# EAGLE design 7 Segment master (EAGLE 9.6.2)
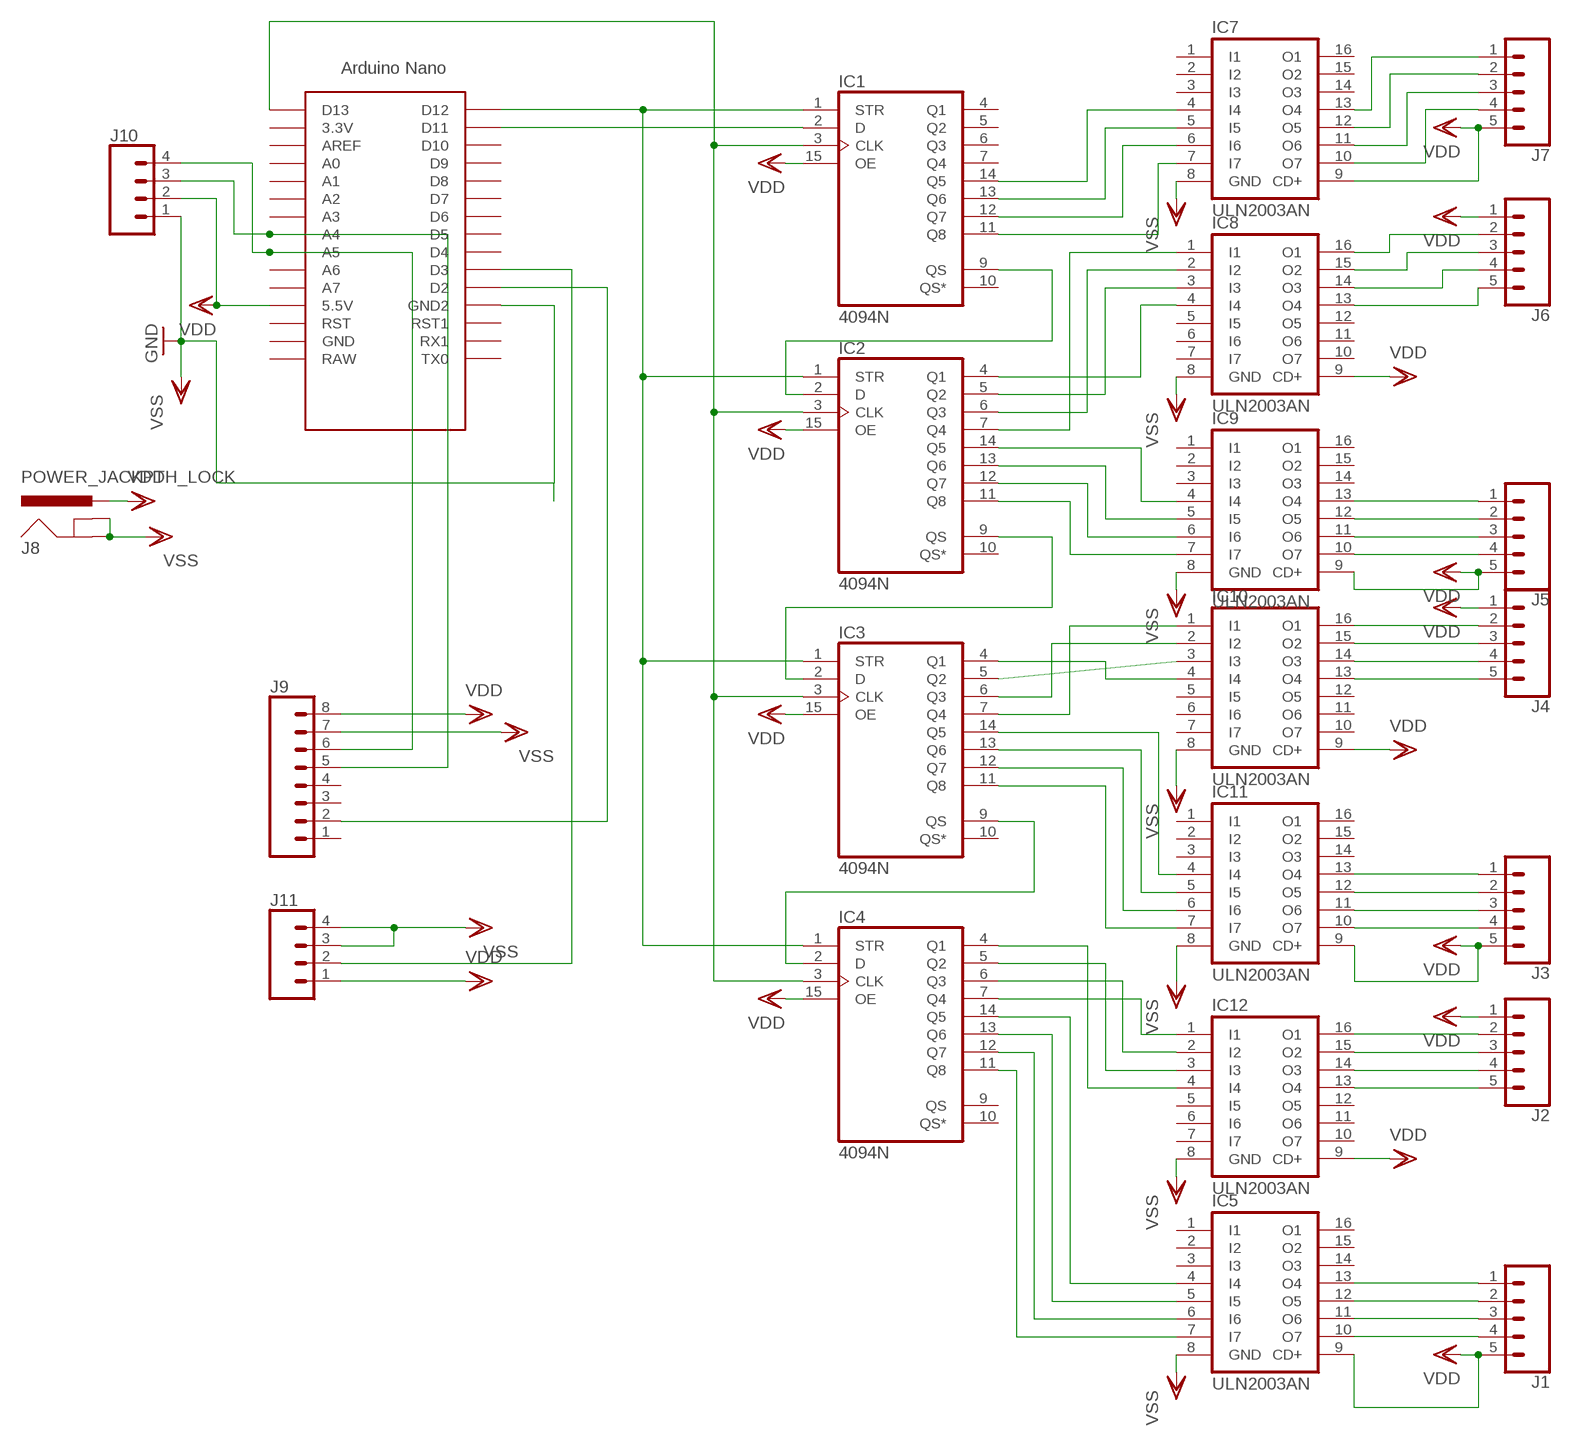
[diagram p0: schematic, sheet 1]

## Parts
IC1  4094N  [DIL16]
IC2  4094N  [DIL16]
IC3  4094N  [DIL16]
IC4  4094N  [DIL16]
IC5  ULN2003AN  [DIL16]
IC7  ULN2003AN  [DIL16]
IC8  ULN2003AN  [DIL16]
IC9  ULN2003AN  [DIL16]
IC10  ULN2003AN  [DIL16]
IC11  ULN2003AN  [DIL16]
IC12  ULN2003AN  [DIL16]
J1  CONN_05LOCK_LONGPADS  [1X05_LOCK_LONGPADS]
J2  CONN_05LOCK_LONGPADS  [1X05_LOCK_LONGPADS]
J3  CONN_05LOCK_LONGPADS  [1X05_LOCK_LONGPADS]
J4  CONN_05LOCK_LONGPADS  [1X05_LOCK_LONGPADS]
J5  CONN_05LOCK_LONGPADS  [1X05_LOCK_LONGPADS]
J6  CONN_05LOCK_LONGPADS  [1X05_LOCK_LONGPADS]
J7  CONN_05LOCK_LONGPADS  [1X05_LOCK_LONGPADS]
J8  POWER_JACKPTH_LOCK  [POWER_JACK_PTH_LOCK]
J9  CONN_08LOCK_LONGPADS  [1X08_LOCK_LONGPADS]
J10  CONN_04  [SCREWTERMINAL-5MM-4]
J11  CONN_04LOCK_LONGPADS  [1X04_LOCK_LONGPADS]
U$1  NANO  [NANO]

## Nets
N$1: IC1.3(CLK) IC2.3(CLK) IC3.3(CLK) IC4.3(CLK) U$1.D13
N$2: IC1.2(D) U$1.D11
N$3: IC1.9(QS) IC2.2(D)
N$4: IC2.9(QS) IC3.2(D)
N$5: IC1.1(STR) IC2.1(STR) IC3.1(STR) IC4.1(STR) U$1.D12
N$6: IC3.9(QS) IC4.2(D)
N$7: IC1.14(Q5) IC7.4(I4)
N$8: IC1.13(Q6) IC7.5(I5)
N$9: IC1.12(Q7) IC7.6(I6)
N$10: IC1.11(Q8) IC7.7(I7)
N$11: IC2.4(Q1) IC8.4(I4)
N$12: IC2.5(Q2) IC8.3(I3)
N$13: IC2.6(Q3) IC8.2(I2)
N$14: IC2.7(Q4) IC8.1(I1)
N$15: IC2.14(Q5) IC9.4(I4)
N$16: IC2.11(Q8) IC9.7(I7)
N$17: IC2.12(Q7) IC9.6(I6)
N$18: IC2.13(Q6) IC9.5(I5)
N$19: IC3.4(Q1) IC10.4(I4)
N$20: IC3.5(Q2) IC10.3(I3)
N$21: IC3.6(Q3) IC10.2(I2)
N$22: IC3.7(Q4) IC10.1(I1)
N$23: IC3.14(Q5) IC11.4(I4)
N$24: IC3.13(Q6) IC11.5(I5)
N$25: IC3.12(Q7) IC11.6(I6)
N$26: IC3.11(Q8) IC11.7(I7)
N$27: IC4.4(Q1) IC12.4(I4)
N$28: IC4.5(Q2) IC12.3(I3)
N$29: IC4.6(Q3) IC12.2(I2)
N$30: IC4.7(Q4) IC12.1(I1)
N$31: IC4.14(Q5) IC5.4(I4)
N$32: IC4.13(Q6) IC5.5(I5)
N$33: IC4.12(Q7) IC5.6(I6)
N$34: IC4.11(Q8) IC5.7(I7)
N$35: IC7.10(O7) J7.4
N$36: IC7.11(O6) J7.3
N$37: IC7.12(O5) J7.2
N$38: IC7.13(O4) J7.1
N$39: IC8.16(O1) J6.2
N$40: IC8.15(O2) J6.3
N$41: IC8.14(O3) J6.4
N$42: IC8.13(O4) J6.5
N$43: IC9.13(O4) J5.1
N$44: IC9.12(O5) J5.2
N$45: IC9.11(O6) J5.3
N$46: IC9.10(O7) J5.4
N$47: IC10.16(O1) J4.2
N$48: IC10.15(O2) J4.3
N$49: IC10.14(O3) J4.4
N$50: IC10.13(O4) J4.5
N$51: IC11.13(O4) J3.1
N$52: IC11.12(O5) J3.2
N$53: IC11.11(O6) J3.3
N$54: IC11.10(O7) J3.4
N$55: IC12.16(O1) J2.2
N$56: IC12.15(O2) J2.3
N$57: IC12.14(O3) J2.4
N$58: IC12.13(O4) J2.5
N$59: IC5.13(O4) J1.1
N$60: IC5.12(O5) J1.2
N$61: IC5.11(O6) J1.3
N$62: IC5.10(O7) J1.4
N$63: J9.6 J10.4 U$1.A5
N$64: J9.5 J10.3 U$1.A4
N$70: J9.2 U$1.D2
N$71: J11.2 U$1.D3
VDD: IC1.15(OE) IC2.15(OE) IC3.15(OE) IC4.15(OE) IC5.9(CD+) IC7.9(CD+) IC8.9(CD+) IC9.9(CD+) IC10.9(CD+) IC11.9(CD+) IC12.9(CD+) J1.5 J2.1 J3.5 J4.1 J5.5 J6.1 J7.5 J8.PWR J9.8 J10.2 J11.1 U$1.5V(5.5V)
VSS: IC5.8(GND) IC7.8(GND) IC8.8(GND) IC9.8(GND) IC10.8(GND) IC11.8(GND) IC12.8(GND) J8.GND J8.GNDBREAK J9.7 J10.1 J11.3 J11.4 U$1.GND1(GND2) ; supply symbol labelled GND
Unconnected: IC1.4(Q1) IC1.5(Q2) IC1.6(Q3) IC1.7(Q4) IC1.10(QS*) IC2.10(QS*) IC3.10(QS*) IC4.9(QS) IC4.10(QS*) IC5.1(I1) IC5.2(I2) IC5.3(I3) IC5.14(O3) IC5.15(O2) IC5.16(O1) IC7.1(I1) IC7.2(I2) IC7.3(I3) IC7.14(O3) IC7.15(O2) IC7.16(O1) IC8.5(I5) IC8.6(I6) IC8.7(I7) IC8.10(O7) IC8.11(O6) IC8.12(O5) IC9.1(I1) IC9.2(I2) IC9.3(I3) IC9.14(O3) IC9.15(O2) IC9.16(O1) IC10.5(I5) IC10.6(I6) IC10.7(I7) IC10.10(O7) IC10.11(O6) IC10.12(O5) IC11.1(I1) IC11.2(I2) IC11.3(I3) IC11.14(O3) IC11.15(O2) IC11.16(O1) IC12.5(I5) IC12.6(I6) IC12.7(I7) IC12.10(O7) IC12.11(O6) IC12.12(O5) J9.1 J9.3 J9.4 U$1.3.3V U$1.A0 U$1.A1 U$1.A2 U$1.A3 U$1.A6 U$1.A7 U$1.AREF U$1.D4 U$1.D5 U$1.D6 U$1.D7 U$1.D8 U$1.D9 U$1.D10 U$1.GND U$1.RAW U$1.RST U$1.RST1 U$1.RX1 U$1.TX0

## Power pins joined to a net without a drawn wire
VDD: IC1.16(VDD) IC2.16(VDD) IC3.16(VDD) IC4.16(VDD)
VSS: IC1.8(VSS) IC2.8(VSS) IC3.8(VSS) IC4.8(VSS)

## Library data of the parts
IC1-IC4 = 40xx:4094: 8-stage SHIFT/STORE REGISTER, tri-state
IC5 IC7-IC12 = uln-udn:ULN2003A: DRIVER ARRAY
J1-J7 = SparkFun-Connectors:CONN_05: Multi connection point. Often used as Generic Header-pin footprint for 0.1 inch spaced/style header connections On any of the 0.1 inch spaced packages, you can populate with these: Break Away Headers - Straight <https://www.sparkfun.com/products/116> (PRT-00116) Break Away Male Headers - Right Angle <https://www.sparkfun.com/products/553> (PRT-00553) Female Headers <https://www.sparkfun.com/products/115> (PRT-00115) Break Away Headers - Machine Pin <https://www.sparkfun.com/products/117> (PRT-00117) Break Away Female Headers - Swiss Machine Pin <https://www.sparkfun.com/products/743> (PRT-00743) For SCREWTERMINALS and SPRING TERMINALS visit here: Screw Terimnals on SparkFun.com <https://www.sparkfun.com/search/results?term=Screw+Terminals> (5mm/3.5mm/2.54mm spacing) This device is also useful as a general connection point to wire up your design to another part of your project. Our various solder wires solder well into these plated through hole pads. Hook-Up Wire - Assortment (Stranded, 22 AWG) <https://www.sparkfun.com/products/11375> (PRT-11375) Hook-Up Wire - Assortment (Solid Core, 22 AWG) <https://www.sparkfun.com/products/11367> (PRT-11367) View the entire wire category on our website here <https://www.sparkfun.com/categories/141> Special notes: Molex polarized connector foot print use with SKU : PRT-08231 with associated crimp pins and housings. 1MM SMD Version SKU: PRT-10208
J8 = SparkFun-Connectors:POWER_JACK: Power Jack Connector This is the standard 5.5mm barrel jack for power. The PTH is the most common, proven, reliable, footprint. The Slot footprint only works if the mill layer is transmitted to the PCB fab house so be warned. Here are the connectors we sell at SparkFun: DC Barrel Power Jack/Connector <https://www.sparkfun.com/products/119> (PRT-00119) DC Barrel Power Jack/Connector (SMD) <https://www.sparkfun.com/products/12748> (PRT-12748) DC Barrel Jack Adapter - Breadboard Compatible <https://www.sparkfun.com/products/10811> (PRT-10811) It is used on this SparkFun product (and many, many others): SparkFun RedBoard - Programmed with Arduino <https://www.sparkfun.com/products/12757> (DEV-12757) Also, if you need a mating power supply or connector, please check these out: Wall Adapter Power Supply - 9VDC 650mA <https://www.sparkfun.com/products/298> (TOL-00298) DC Barrel Jack Adapter - Male <https://www.sparkfun.com/products/10287> (PRT-10287); PROD_ID: CONN-08197; SF_ID: PRT-00119
J9 = SparkFun-Connectors:CONN_08: Multi connection point. Often used as Generic Header-pin footprint for 0.1 inch spaced/style header connections On any of the 0.1 inch spaced packages, you can populate with these: Break Away Headers - Straight <https://www.sparkfun.com/products/116> (PRT-00116) Break Away Male Headers - Right Angle <https://www.sparkfun.com/products/553> (PRT-00553) Female Headers <https://www.sparkfun.com/products/115> (PRT-00115) Break Away Headers - Machine Pin <https://www.sparkfun.com/products/117> (PRT-00117) Break Away Female Headers - Swiss Machine Pin <https://www.sparkfun.com/products/743> (PRT-00743) Arduino Stackable Header - 8 Pin <https://www.sparkfun.com/products/9279> (PRT-09279) For SCREWTERMINALS and SPRING TERMINALS visit here: Screw Terimnals on SparkFun.com <https://www.sparkfun.com/search/results?term=Screw+Terminals> (5mm/3.5mm/2.54mm spacing) This device is also useful as a general connection point to wire up your design to another part of your project. Our various solder wires solder well into these plated through hole pads. Hook-Up Wire - Assortment (Stranded, 22 AWG) <https://www.sparkfun.com/products/11375> (PRT-11375) Hook-Up Wire - Assortment (Solid Core, 22 AWG) <https://www.sparkfun.com/products/11367> (PRT-11367) View the entire wire category on our website here <https://www.sparkfun.com/categories/141> Special notes: Molex polarized connector foot print use with SKU : PRT-08231 with associated crimp pins and housings. 1MM SMD Version SKU: PRT-10208 NOTES ON THE VARIANTS LOCK and LOCK_LONGPADS... This footprint was designed to help hold the alignment of a through-hole component (i.e. 6-pin header) while soldering it into place. You may notice that each hole has been shifted either up or down by 0.005 of an inch from it's more standard position (which is a perfectly straight line). This slight alteration caused the pins (the squares in the middle) to touch the edges of the holes. Because they are alternating, it causes a "brace" to hold the component in place. 0.005 has proven to be the perfect amount of "off-center" position when using our standard breakaway headers. Although looks a little odd when you look at the bare footprint, once you have a header in there, the alteration is very hard to notice. Also,if you push a header all the way into place, it is covered up entirely on the bottom side.
J10 = Chris:CONN_04: Multi connection point. Often used as Generic Header-pin footprint for 0.1 inch spaced/style header connections On any of the 0.1 inch spaced packages, you can populate with these: Break Away Headers - Straight <https://www.sparkfun.com/products/116> (PRT-00116) Break Away Male Headers - Right Angle <https://www.sparkfun.com/products/553> (PRT-00553) Female Headers <https://www.sparkfun.com/products/115> (PRT-00115) Break Away Headers - Machine Pin <https://www.sparkfun.com/products/117> (PRT-00117) Break Away Female Headers - Swiss Machine Pin <https://www.sparkfun.com/products/743> (PRT-00743) For SCREWTERMINALS and SPRING TERMINALS visit here: Screw Terimnals on SparkFun.com <https://www.sparkfun.com/search/results?term=Screw+Terminals> (5mm/3.5mm/2.54mm spacing) This device is also useful as a general connection point to wire up your design to another part of your project. Our various solder wires solder well into these plated through hole pads. Hook-Up Wire - Assortment (Stranded, 22 AWG) <https://www.sparkfun.com/products/11375> (PRT-11375) Hook-Up Wire - Assortment (Solid Core, 22 AWG) <https://www.sparkfun.com/products/11367> (PRT-11367) View the entire wire category on our website here <https://www.sparkfun.com/categories/141> Special notes: Molex polarized connector foot print use with SKU : PRT-08231 with associated crimp pins and housings. 1MM SMD Version SKU: PRT-10208
J11 = SparkFun-Connectors:CONN_04: Multi connection point. Often used as Generic Header-pin footprint for 0.1 inch spaced/style header connections On any of the 0.1 inch spaced packages, you can populate with these: Break Away Headers - Straight <https://www.sparkfun.com/products/116> (PRT-00116) Break Away Male Headers - Right Angle <https://www.sparkfun.com/products/553> (PRT-00553) Female Headers <https://www.sparkfun.com/products/115> (PRT-00115) Break Away Headers - Machine Pin <https://www.sparkfun.com/products/117> (PRT-00117) Break Away Female Headers - Swiss Machine Pin <https://www.sparkfun.com/products/743> (PRT-00743) For SCREWTERMINALS and SPRING TERMINALS visit here: Screw Terimnals on SparkFun.com <https://www.sparkfun.com/search/results?term=Screw+Terminals> (5mm/3.5mm/2.54mm spacing) This device is also useful as a general connection point to wire up your design to another part of your project. Our various solder wires solder well into these plated through hole pads. Hook-Up Wire - Assortment (Stranded, 22 AWG) <https://www.sparkfun.com/products/11375> (PRT-11375) Hook-Up Wire - Assortment (Solid Core, 22 AWG) <https://www.sparkfun.com/products/11367> (PRT-11367) View the entire wire category on our website here <https://www.sparkfun.com/categories/141> Special notes: Molex polarized connector foot print use with SKU : PRT-08231 with associated crimp pins and housings. 1MM SMD Version SKU: PRT-10208; PROD_ID: CONN-09696
U$1 = Arduino-clone:NANO: Arduino Nano

## Board
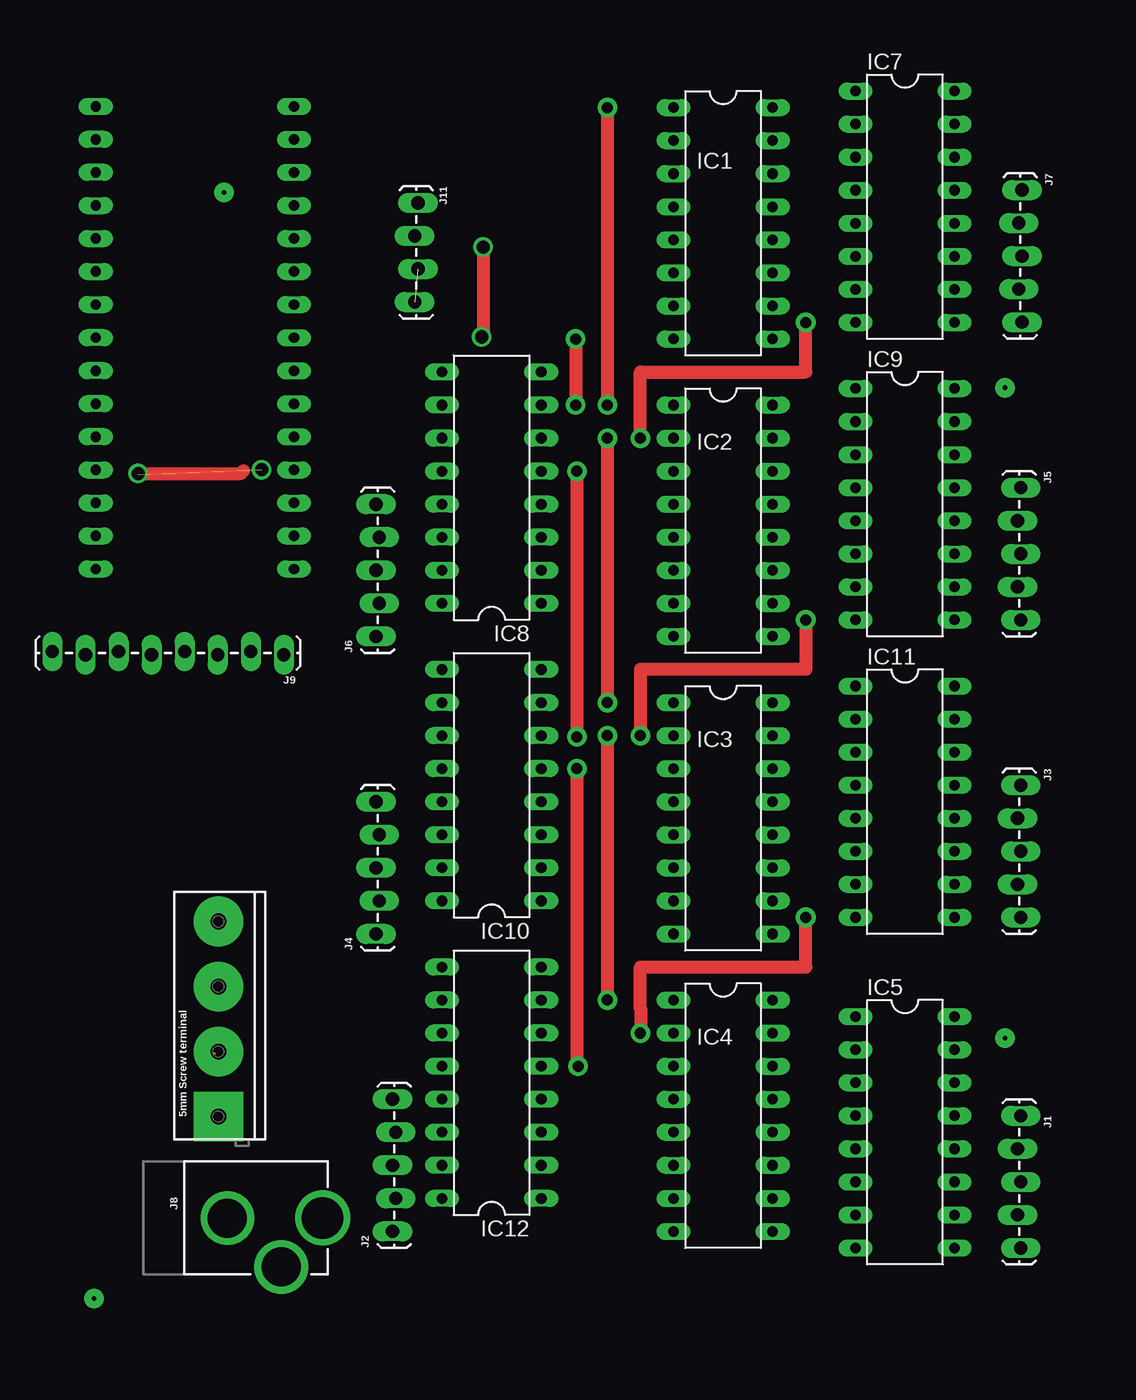
[diagram p1: board, top side]
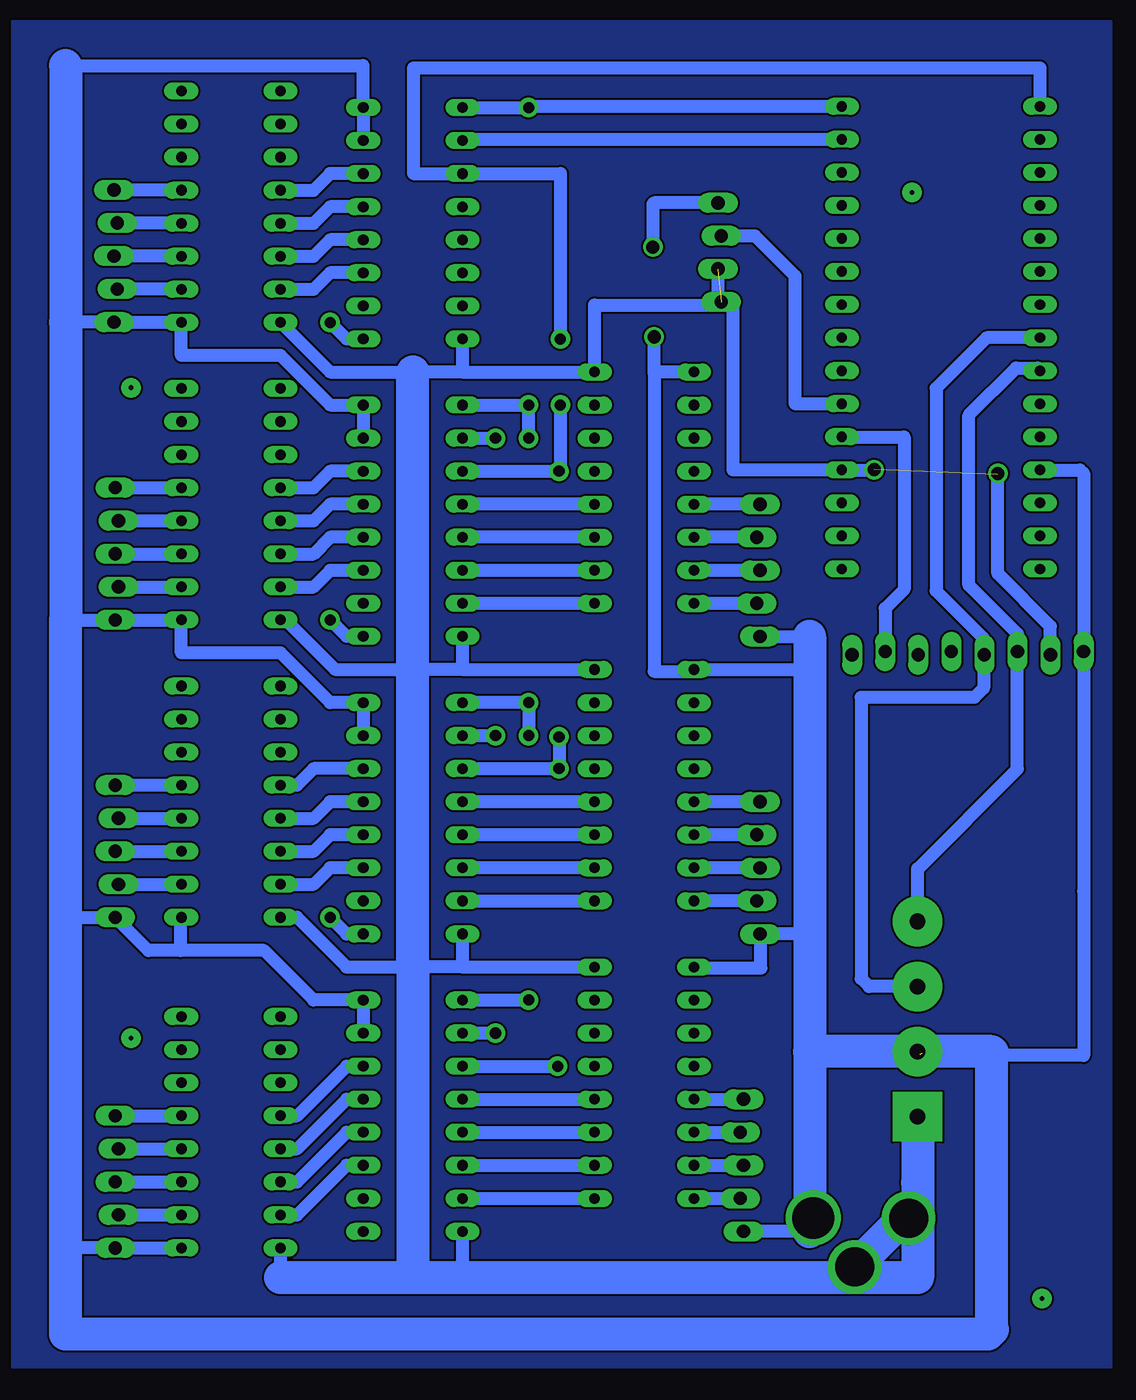
[diagram p2: board, bottom side, seen from below]

No outline drawn. Coordinates in mm, seen from the top.
Copper layers (1*16): Top 0.035mm / dielectric 1.5mm / Bottom 0.035mm
Design rules "default": minimum track width 6mil, minimum drill 0.35mm, track to track 6mil, track to pad 6mil, pad to pad 6mil, via to via 6mil, smd to smd 6mil, copper to edge 40mil, drill to drill 6mil, minimum pad ring 10mil, minimum via ring 8mil, stop-mask expansion 4mil, vias tented up to drill 0mil, thermal gap 10mil

### Footprints (pad centres in the part's own frame; a part is rotated, then mirrored left to right if it is on the bottom)
DIL16 = drill 0.813 long: 1 -8.89,-3.81; 2 -6.35,-3.81; 3 -3.81,-3.81; 4 -1.27,-3.81; 5 1.27,-3.81; 6 3.81,-3.81; 7 6.35,-3.81; 8 8.89,-3.81; 9 8.89,3.81; 10 6.35,3.81; 11 3.81,3.81; 12 1.27,3.81; 13 -1.27,3.81; 14 -3.81,3.81; 15 -6.35,3.81; 16 -8.89,3.81
1X05_LOCK_LONGPADS = drill 1.016 long: 1 0,0; 2 2.54,-0.254; 3 5.08,0; 4 7.62,-0.254; 5 10.16,0
POWER_JACK_PTH_LOCK = drill 2.997 pad 4.115: GND 0.025,6.557; GNDBREAK 3.762,10.7 | drill 3.2 pad 4.115: PWR 0,13.878
1X08_LOCK_LONGPADS = drill 1.016 long: 1 0,0.127; 2 2.54,-0.127; 3 5.08,0.127; 4 7.62,-0.127; 5 10.16,0.127; 6 12.7,-0.127; 7 15.24,0.127; 8 17.78,-0.127
SCREWTERMINAL-5MM-4 = drill 1.2 pad 3.81 square: 1 0,0 | drill 1.2 pad 3.81: 2 5,0; 3 10,0; 4 15,0
1X04_LOCK_LONGPADS = drill 1.016 long: 1 0,0; 2 2.54,-0.254; 3 5.08,0; 4 7.62,-0.254
NANO = drill 0.8 long: 3.3V -10.16,24.13; 5V -10.16,-1.27; A0 -10.16,19.05; A1 -10.16,16.51; A2 -10.16,13.97; A3 -10.16,11.43; A4 -10.16,8.89; A5 -10.16,6.35; A6 -10.16,3.81; A7 -10.16,1.27; AREF -10.16,21.59; D2 5.08,1.27; D3 5.08,3.81; D4 5.08,6.35; D5 5.08,8.89; D6 5.08,11.43; D7 5.08,13.97; D8 5.08,16.51; D9 5.08,19.05; D10 5.08,21.59; D11 5.08,24.13; D12 5.08,26.67; D13 -10.16,26.67; GND -10.16,-6.35; GND1 5.08,-1.27; RAW -10.16,-8.89; RST -10.16,-3.81; RST1 5.08,-3.81; RX1 5.08,-6.35; TX0 5.08,-8.89

### Placement (x,y rotation side)
IC1  53.34,87.63 270 top
IC2  53.34,64.77 270 top
IC3  53.34,41.91 270 top
IC4  53.34,19.05 270 top
IC5  67.31,17.78 270 top
IC7  67.31,88.9 270 top
IC8  35.56,67.31 90 top
IC9  67.31,66.04 270 top
IC10  35.56,44.45 90 top
IC11  67.31,43.18 270 top
IC12  35.56,21.59 90 top
J1  76.2,19.05 270 top
J2  27.94,10.16 90 top
J3  76.2,44.45 270 top
J4  26.67,33.02 90 top
J5  76.2,67.31 270 top
J6  26.67,55.88 90 top
J7  76.3,90.19 270 top
J8  8.7,11.2 270 top
J9  19.6,54.6 180 top
J10  14.57,18.98 90 top
J11  29.9,89.2 270 top
U$1  15.31,69.95 0 top

### Tracks (layer width: path | path; a pad name or v marks a point on that pad's centre or on a via)
_OUTLINES_
  pour Bottom (isolate 0.025, rank 6): 0,0 83.82,0 83.82,102.87 0,102.87
  pour Bottom (isolate 0.1, rank 6): -0.09,-0.09 83.91,-0.09 83.91,102.96 -0.09,102.96
  pour Bottom (isolate 0.1, rank 6): -0.19,-0.19 84.01,-0.19 84.01,103.06 -0.19,103.06
  pour Bottom (isolate 0.1, rank 6): -0.29,-0.29 84.11,-0.29 84.11,103.16 -0.29,103.16
N$1  (via drill 0.85 pad 1.5)
  Top 1.016: v42.01,78.74 v42.01,73.66 | v42.11,68.58 v42.11,48.16 | v42.11,45.72 42.11,22.96 v42.21,22.86
  Bottom 1.016: U$1.D13 5.15,99.56 53.3,99.56 53.3,91.44 IC1.3 42.01,91.44 v42.01,78.74 | IC2.3 v42.11,68.58 42.01,68.68 v42.01,73.66 | IC3.3 v42.11,45.72 v42.11,48.16 | IC4.3 v42.21,22.86
N$2
  Bottom 1.016: U$1.D11 49.43,94.08 IC1.2
N$3  (via drill 0.85 pad 1.5)
  Top 1.016: v46.99,71.12 46.99,76.2 59.69,76.2 v59.69,80.01
  Bottom 1.016: IC1.9 58.42,78.74 v59.69,80.01 | IC2.2 v46.99,71.12
N$4  (via drill 0.85 pad 1.5)
  Top 1.016: v59.69,57.15 59.69,53.34 46.99,53.34 v46.99,48.26
  Bottom 1.016: IC2.9 58.42,55.88 v59.69,57.15 | IC3.2 v46.99,48.26
N$5  (via drill 0.85 pad 1.5)
  Top 1.016: v44.45,71.12 v44.45,50.8 | v44.45,96.52 v44.45,73.66 | v44.45,48.26 v44.45,27.94
  Bottom 1.016: IC1.1 v44.45,96.52 44.35,96.62 U$1.D12 | v44.45,71.12 v44.45,73.66 IC2.1 | IC3.1 v44.45,50.8 v44.45,48.26 | IC4.1 v44.45,27.94
N$6  (via drill 0.85 pad 1.5)
  Top 1.016: v46.99,25.4 47.03,25.44 47.03,27.21 46.99,27.25 46.99,30.48 59.69,30.48 v59.69,34.29
  Bottom 1.016: IC4.2 v46.99,25.4 | IC3.9 58.42,33.02 v59.69,34.29
N$7
  Bottom 1.016: IC1.14 59.69,91.44 60.96,90.17 IC7.4
N$8
  Bottom 1.016: IC1.13 59.69,88.9 60.96,87.63 IC7.5
N$9
  Bottom 1.016: IC1.12 59.69,86.36 60.96,85.09 IC7.6
N$10
  Bottom 1.016: IC1.11 59.69,83.82 60.96,82.55 IC7.7
N$11
  Bottom 1.016: IC8.4 IC2.4
N$12
  Bottom 1.016: IC8.3 IC2.5
N$13
  Bottom 1.016: IC8.2 IC2.6
N$14
  Bottom 1.016: IC8.1 IC2.7
N$15
  Bottom 1.016: IC2.14 59.69,68.58 60.96,67.31 IC9.4
N$16
  Bottom 1.016: IC9.7 60.96,59.69 59.69,60.96 IC2.11
N$17
  Bottom 1.016: IC2.12 59.69,63.5 60.96,62.23 IC9.6
N$18
  Bottom 1.016: IC2.13 59.69,66.04 60.96,64.77 IC9.5
N$19
  Bottom 1.016: IC10.4 IC3.4
N$20
  Bottom 1.016: IC10.3 IC3.5
N$21
  Bottom 1.016: IC10.2 IC3.6
N$22
  Bottom 1.016: IC3.7 IC10.1
N$23
  Bottom 1.016: IC3.14 60.96,45.72 62.23,44.45 IC11.4
N$24
  Bottom 1.016: IC3.13 59.69,43.18 60.96,41.91 IC11.5
N$25
  Bottom 1.016: IC3.12 59.69,40.64 60.96,39.37 IC11.6
N$26
  Bottom 1.016: IC3.11 59.69,38.1 60.96,36.83 IC11.7
N$27
  Bottom 1.016: IC4.4 IC12.4
N$28
  Bottom 1.016: IC4.5 IC12.3
N$29
  Bottom 1.016: IC4.6 IC12.2
N$30
  Bottom 1.016: IC4.7 IC12.1
N$31
  Bottom 1.016: IC5.4 62.23,19.05 58.42,22.86 IC4.14
N$32
  Bottom 1.016: IC5.5 62.23,16.51 58.42,20.32 IC4.13
N$33
  Bottom 1.016: IC5.6 62.23,13.97 58.42,17.78 IC4.12
N$34
  Bottom 1.016: IC5.7 62.23,11.43 58.42,15.24 IC4.11
N$35
  Bottom 1.016: IC7.10 76.03,82.55 J7.4
N$36
  Bottom 1.016: IC7.11 76.28,85.09 J7.3
N$37
  Bottom 1.016: IC7.12 76.03,87.63 J7.2
N$38
  Bottom 1.016: IC7.13 71.14,90.19 J7.1
N$39
  Bottom 1.016: J6.2 IC8.16
N$40
  Bottom 1.016: J6.3 IC8.15
N$41
  Bottom 1.016: J6.4 IC8.14
N$42
  Bottom 1.016: J6.5 IC8.13
N$43
  Bottom 1.016: J5.1 IC9.13
N$44
  Bottom 1.016: J5.2 IC9.12
N$45
  Bottom 1.016: J5.3 IC9.11
N$46
  Bottom 1.016: J5.4 IC9.10
N$47
  Bottom 1.016: J4.2 IC10.16
N$48
  Bottom 1.016: J4.3 IC10.15
N$49
  Bottom 1.016: J4.4 IC10.14
N$50
  Bottom 1.016: J4.5 IC10.13
N$51
  Bottom 1.016: J3.1 IC11.13
N$52
  Bottom 1.016: J3.2 IC11.12
N$53
  Bottom 1.016: J3.3 IC11.11
N$54
  Bottom 1.016: J3.4 IC11.10
N$55
  Bottom 1.016: IC12.16 J2.2
N$56
  Bottom 1.016: IC12.15 J2.3
N$57
  Bottom 1.016: IC12.14 J2.4
N$58
  Bottom 1.016: IC12.13 J2.5
N$59
  Bottom 1.016: J1.1 IC5.13
N$60
  Bottom 1.016: J1.2 IC5.12
N$61
  Bottom 1.016: J1.3 IC5.11
N$62
  Bottom 1.016: J1.4 IC5.10
N$63
  Bottom 1.016: J10.4 14.57,38.03 6.9,45.7 J9.6 6.9,56.1 10.62,59.82 10.62,72.88 7,76.5 5.35,76.5 U$1.A5
N$64
  Bottom 1.016: U$1.A4 9.26,78.84 13.14,74.96 13.14,59.37 9.54,55.77 9.54,54.57 J9.5 9.5,54.41 9.5,51.9 10.2,51.2 18.9,51.2 18.9,29.6 18.28,28.98 J10.3
N$65  (via drill 0.35 pad 1.5)
  other vias: 5,5
N$66  (via drill 0.35 pad 1.5)
  other vias: 75,25
N$67  (via drill 0.35 pad 1.5)
  other vias: 75,75
N$68  (via drill 0.35 pad 1.5)
  other vias: 15,90
N$69  (via drill 1)
  Top 1.016: v8.4,68.4 16.29,68.4 16.49,68.6
N$70
  Bottom 1.016: U$1.D2 20.37,71.2 15.6,71.2 15.6,59.49 17.06,58.03 J9.2
N$71
  Bottom 1.016: J11.2 27.06,86.66 24,83.6 24,73.8 23.96,73.76 U$1.D3
N$72  (via drill 1)
  other vias: 17.9,68.7
VDD  (via drill 1)  (1 unrouted)
  Top 1.016: v34.9,85.8 34.9,79 v34.8,78.9
  Bottom 1.016: IC5.9 J1.5 80.01,8.89 | IC3.15 IC3.16 59.69,50.8 63.5,54.61 71.12,54.61 IC9.9 J5.5 80.01,57.15 | IC2.15 IC2.16 59.69,73.66 63.5,77.47 71.12,77.47 IC7.9 76.3,80.01 J7.5 80.01,80.03 | IC4.15 IC4.16 60.96,27.94 64.77,31.75 71.2,31.75 | IC1.15 IC1.16 57.15,99.75 80.01,99.75 | 71.2,31.75 73.66,31.75 J3.5 80.01,34.29 | J6.1 22.86,55.88 | 22.86,33.02 J4.1 26.6,32.95 26.6,30.4 31.67,30.4 IC12.9 | 22.86,10.16 J2.1 | 22.86,53.5 23.02,53.34 IC10.9 31.89,53.2 34.8,53.2 34.8,76.1 34.7,76.2 | IC8.9 34.7,76.2 | IC11.9 71.2,34.21 71.2,31.75 | U$1.5V 2.08,68.68 1.82,68.42 J9.8 1.82,36.32 | 1.8,36.3 1.82,36.32 | 14.2,23.9 14.2,23.56 | 34.7,76.2 34.8,76.3 v34.8,78.9 34.8,79.1 | J11.1 34.8,89.2 34.9,89.1 v34.9,85.8 34.9,85.6 | 8.88,23.69 1.82,23.69 1.82,36.32
  Bottom 2.54: 80.01,99.75 80.01,80.03 80.01,57.15 80.01,34.29 80.01,8.89 80.01,2.29 9.14,2.29 8.88,2.55 | 22.86,55.88 22.86,53.5 22.86,33.02 22.86,23.98 | 22.86,23.98 22.86,11.2 | 22.86,11.2 22.86,10.16 | J10.2 14.35,23.76 | J8.PWR 22.86,11.2 | J10.2 22.86,23.98 | 8.88,2.55 8.8,2.63 | 8.88,23.98 8.8,23.9 | 8.88,23.98 J10.2 | 8.88,2.55 8.88,23.69 8.88,23.98
VSS  (2 unrouted)
  Bottom 1.016: IC4.8 49.53,6.6 | 63.5,6.6 IC5.8 | IC3.8 49.53,30.48 | 49.53,30.48 53.34,30.48 58.42,30.48 62.23,34.29 IC11.8 | IC2.8 49.53,53.34 | 49.53,53.34 53.34,53.34 59.31,53.34 63.12,57.15 IC9.8 | IC1.8 49.53,76.2 | IC7.8 59.69,76.2 53.34,76.2 49.53,76.2 | 49.53,53.34 IC10.8 | 49.53,30.48 IC12.8 | 49.53,76.2 IC8.8 39.37,81.34 29.9,81.34 | 29.9,81.34 28.73,81.34 28.73,68.68 U$1.GND1 17.92,68.68 17.9,68.7 | J11.3 29.9,81.34 | J9.7 4.36,56.66 8.4,60.7 8.4,68.3 | J8.GND 14.57,11.86 14.57,13.9
  Bottom 2.54: 53.34,6.6 49.53,6.6 14.57,6.6 14.57,13.9 J10.1 | 53.34,6.6 63.5,6.6 | 53.34,6.6 53.34,30.48 53.34,53.34 53.34,76.2 | J8.GNDBREAK 15.66,11.18 J8.GND